# EAGLE schematic usb to serial (EAGLE 5.07)
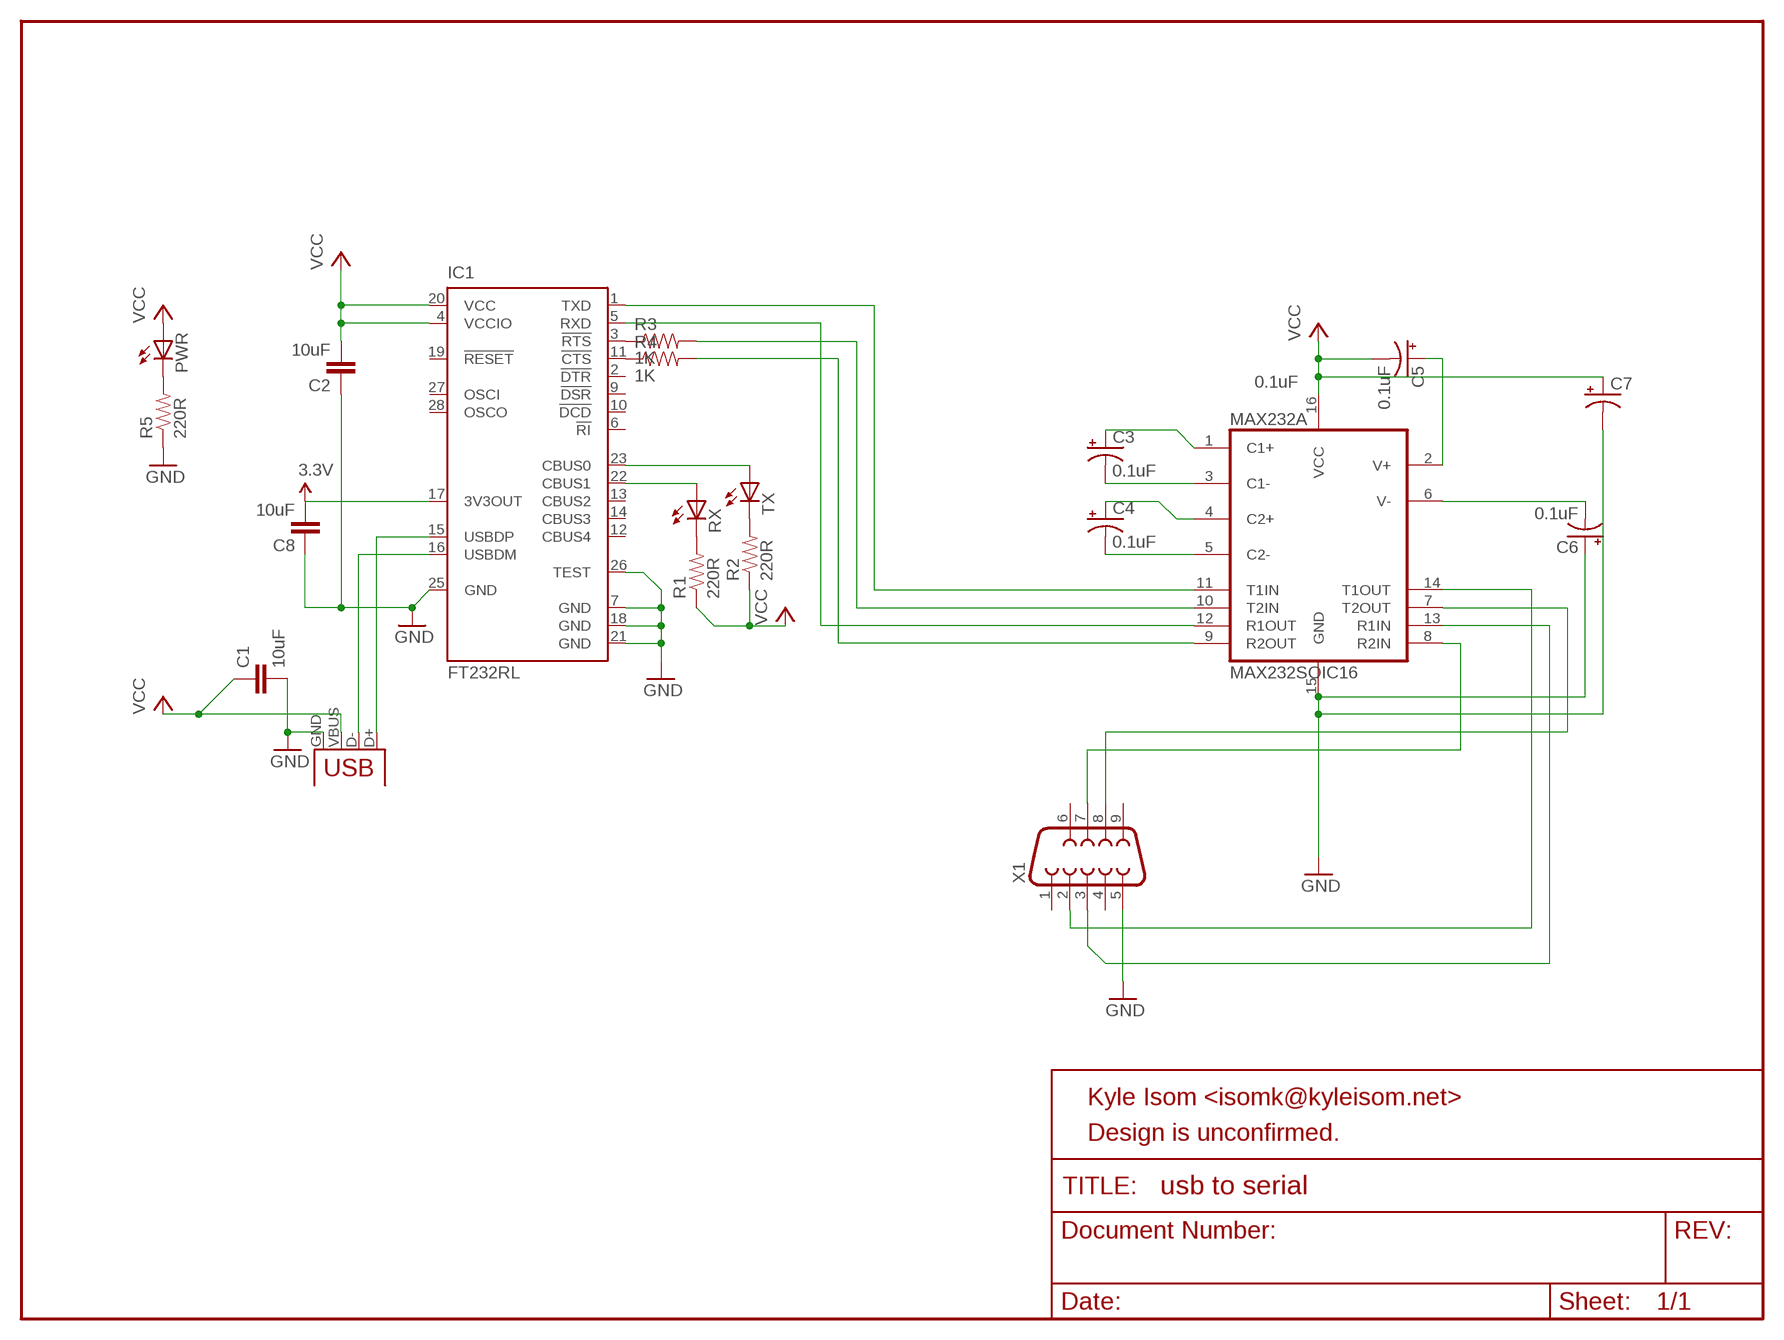
[diagram p0: schematic, sheet 1]

## Parts
C1  10uF  CAPPTH1  [CAP-PTH-5MM]
C2  10uF  CAPPTH1  [CAP-PTH-5MM]
C3  0.1uF  CAP_POLG  [PANASONIC_G]
C4  0.1uF  CAP_POLG  [PANASONIC_G]
C5  0.1uF  CAP_POLG  [PANASONIC_G]
C6  0.1uF  CAP_POLG  [PANASONIC_G]
C7  0.1uF  CAP_POLG  [PANASONIC_G]
C8  10uF  CAPPTH1  [CAP-PTH-5MM]
IC1  FT232RL  [SSOP28]
MAX232A  MAX232SOIC16  [SO016]
PWR  LED  [SMARTLED-TTW]
R1  220R  RESISTOR0603-RES  [0603-RES]
R2  220R  RESISTOR0603-RES  [0603-RES]
R3  1K  RESISTORPTH1  [AXIAL-0.3]
R4  1K  RESISTORPTH1  [AXIAL-0.3]
R5  220R  RESISTORPTH1  [AXIAL-0.3]
RX  LED  [SMARTLED-TTW]
TX  LED  [SMARTLED-TTW]
X1  DB9  [DB9]
X2  USBPTH  [USB-B-PTH]

## Nets
3.3V: C8.2 IC1.17(3V3OUT)
GND: C1.2 C2.1 C6.+ C7.- C8.1 IC1.7(GND) IC1.18(GND) IC1.21(GND) IC1.25(GND) IC1.26(TEST) MAX232A.15(GND) R5.P$1 X1.5 X2.GND
N$1: IC1.15(USBDP) X2.D+
N$2: IC1.16(USBDM) X2.D-
N$3: R1.2 RX.C@1(C)
N$4: R2.2 TX.C@1(C)
N$5: IC1.23(CBUS0) TX.A@1(A)
N$6: IC1.22(CBUS1) RX.A@1(A)
N$7: C3.+ MAX232A.1(C1+)
N$8: C3.- MAX232A.3(C1-)
N$9: C4.+ MAX232A.4(C2+)
N$10: C4.- MAX232A.5(C2-)
N$11: C5.+ MAX232A.2(V+)
N$12: C6.- MAX232A.6(V-)
N$13: IC1.5(RXD) MAX232A.12(R1OUT)
N$14: IC1.3(!RTS) R3.P$1
N$15: IC1.11(!CTS) R4.P$1
N$16: MAX232A.10(T2IN) R3.P$2
N$17: IC1.1(TXD) MAX232A.11(T1IN)
N$18: PWR.C@1(C) R5.P$2
N$20: MAX232A.7(T2OUT) X1.8
N$21: MAX232A.8(R2IN) X1.7
N$27: MAX232A.9(R2OUT) R4.P$2
N$32: MAX232A.13(R1IN) X1.3
N$33: MAX232A.14(T1OUT) X1.2
VCC: C1.1 C2.2 C5.- C7.+ IC1.4(VCCIO) IC1.20(VCC) MAX232A.16(VCC) PWR.A@1(A) R1.1 R2.1 X2.VBUS
Unconnected: IC1.2(!DTR) IC1.6(!RI) IC1.9(!DSR) IC1.10(!DCD) IC1.12(CBUS4) IC1.13(CBUS2) IC1.14(CBUS3) IC1.19(!RESET) IC1.27(OSCI) IC1.28(OSCO) X1.1 X1.4 X1.6 X1.9

## Notes on the sheet
- Kyle Isom <isomk@kyleisom.net>
- Design is unconfirmed.

## Library data of the parts
C1 C2 C8 = SparkFun:CAP: Capacitor Standard 0603 ceramic capacitor, and 0.1" leaded capacitor.
C3-C7 = SparkFun:CAP_POL: Capacitor Polarized These are standard SMD and PTH capacitors. Normally 10uF, 47uF, and 100uF in electrolytic and tantalum varieties. Always verify the external diameter of the through hole cap, it varies with capacity, voltage, and manufacturer. The EIA devices should be standard.
IC1 = ftdichip:FT232R: Source: http://www.ftdichip.com/Documents/DataSheets/DS_FT232R_v104.pdf
MAX232A = SparkFun:MAX232: RS232 Transceiver Very common IC. This is generically called 'MAX232', but works with the 3V equivalent MAX3232 generic ICs. Field tested and mother approved. Spark Fun Electronics SKU : COM-00316 (DIP) and COM-00589 (SMD)
PWR RX TX = led:LED: LED OSRAM: - CHIPLED LG R971, LG N971, LY N971, LG Q971, LY Q971, LO R971, LY R971 LH N974, LH R974 LS Q976, LO Q976, LY Q976 LO Q996 - Hyper CHIPLED LW Q18S LB Q993, LB Q99A, LB R99A - SideLED LS A670, LO A670, LY A670, LG A670, LP A670 LB A673, LV A673, LT A673, LW A673 LH A674 LY A675 LS A676, LA A676, LO A676, LY A676, LW A676 LS A679, LY A679, LG A679 - Hyper Micro SIDELED® LS Y876, LA Y876, LO Y876, LY Y876 LT Y87S - SmartLED LW L88C, LW L88S LB L89C, LB L89S, LG L890 LS L89K, LO L89K, LY L89K LS L896, LA L896, LO L896, LY L896 - TOPLED LS T670, LO T670, LY T670, LG T670, LP T670 LSG T670, LSP T670, LSY T670, LOP T670, LYG T670 LG T671, LOG T671, LSG T671 LB T673, LV T673, LT T673, LW T673 LH T674 LS T676, LA T676, LO T676, LY T676, LB T676, LH T676, LSB T676, LW T676 LB T67C, LV T67C, LT T67C, LS T67K, LO T67K, LY T67K, LW E67C LS E67B, LA E67B, LO E67B, LY E67B, LB E67C, LV E67C, LT E67C LW T67C LS T679, LY T679, LG T679 LS T770, LO T770, LY T770, LG T770, LP T770 LB T773, LV T773, LT T773, LW T773 LH T774 LS E675, LA E675, LY E675, LS T675 LS T776, LA T776, LO T776, LY T776, LB T776 LHGB T686 LT T68C, LB T68C - Hyper Mini TOPLED® LB M676 - Mini TOPLED Santana® LG M470 LS M47K, LO M47K, LY M47K Source: http://www.osram.convergy.de LUXEON: - LUMILED® LXK2-PW12-R00, LXK2-PW12-S00, LXK2-PW14-U00, LXK2-PW14-V00 LXK2-PM12-R00, LXK2-PM12-S00, LXK2-PM14-U00 LXK2-PE12-Q00, LXK2-PE12-R00, LXK2-PE12-S00, LXK2-PE14-T00, LXK2-PE14-U00 LXK2-PB12-K00, LXK2-PB12-L00, LXK2-PB12-M00, LXK2-PB14-N00, LXK2-PB14-P00, LXK2-PB14-Q00 LXK2-PR12-L00, LXK2-PR12-M00, LXK2-PR14-Q00, LXK2-PR14-R00 LXK2-PD12-Q00, LXK2-PD12-R00, LXK2-PD12-S00 LXK2-PH12-R00, LXK2-PH12-S00 LXK2-PL12-P00, LXK2-PL12-Q00, LXK2-PL12-R00 Source: www.luxeon.com KINGBRIGHT: KA-3528ASYC Source: www.kingbright.com
R1-R5 = SparkFun:RESISTOR: Resistor Basic schematic elements and footprints for 0603, 1206, and PTH 1/10th watt (small) resistors.
X1 = SparkFun:DB9: DB9 Connector Standard DB9 (D-Sub 9) serial connector. Can be used for CAN bus as well as RS485 and RS232. Footprint production proven. Spark Fun Electronics SKU : PRT-00429
X2 = SparkFun:USB: USB Connectors USB-B-PTH is fully proven SKU : PRT-00139 USB-miniB is fully proven SKU : PRT-00587 USB-A-PCB is untested. USB-A-H is throughly reviewed, but untested. Spark Fun Electronics SKU : PRT-00437 USB-B-SMT is throughly reviewed, but untested. Needs silkscreen touching up. USB-A-S has not been used/tested USB-MB-H has not been used/tested